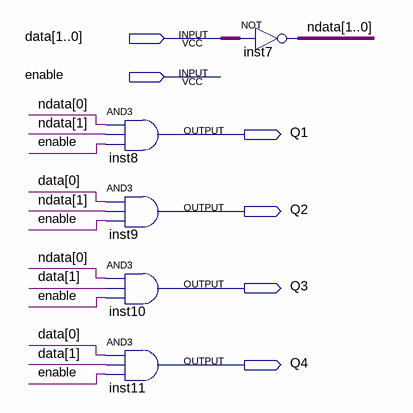
[diagram p0: schematic sheet]
// Quartus schematic dmux1in4.bdf as structural Verilog: 5 symbols, 6 pins
module dmux1in4 (
  input  [1:0] data,
  input  enable,
  output Q1,
  output Q2,
  output Q3,
  output Q4
);

  wire [1:0] ndata;

  and inst8 (Q1, ndata[0], ndata[1], enable);
  and inst9 (Q2, data[0], ndata[1], enable);
  and inst10 (Q3, ndata[0], data[1], enable);
  and inst11 (Q4, data[0], data[1], enable);
  assign ndata = ~data;  // NOT inst7, 2 bits wide
endmodule
